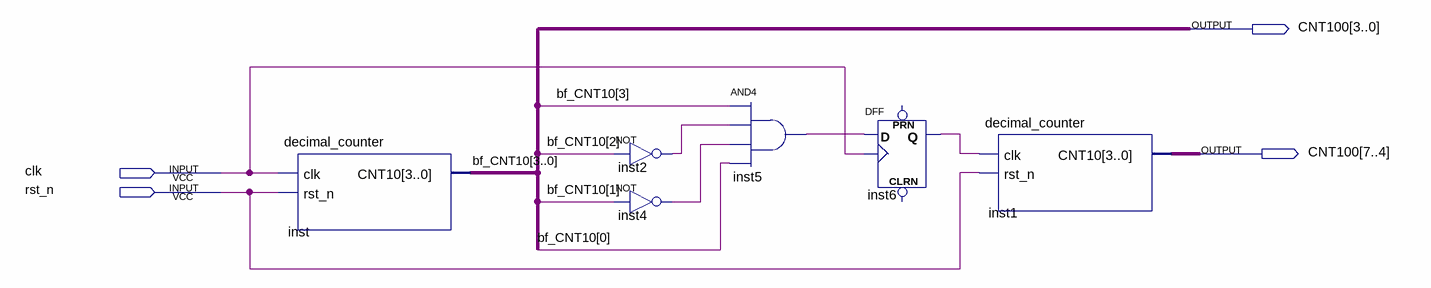
[diagram p0: schematic sheet]
// Quartus schematic work1.bdf as structural Verilog: 6 symbols, 4 pins
module work1 (
  input  clk,
  input  rst_n,
  output [7:0] CNT100
);

  wire inst2_out, inst4_out, inst5_out, inst6_q;

  decimal_counter inst (.clk(clk), .rst_n(rst_n), .CNT10(CNT100[3:0]));
  not inst2 (inst2_out, CNT100[2]);
  not inst4 (inst4_out, CNT100[1]);
  and inst5 (inst5_out, CNT100[3], inst2_out, inst4_out, CNT100[0]);
  DFF inst6 (.CLK(clk), .D(inst5_out), .Q(inst6_q));  // open: CLRN, PRN
  decimal_counter inst1 (.clk(inst6_q), .rst_n(rst_n), .CNT10(CNT100[7:4]));

  // Other names for the same wires on the sheet: bf_CNT10[3:0] = CNT100[3:0]
endmodule
